# EAGLE schematic mapleCUx_large_047 (EAGLE 7.3.0)
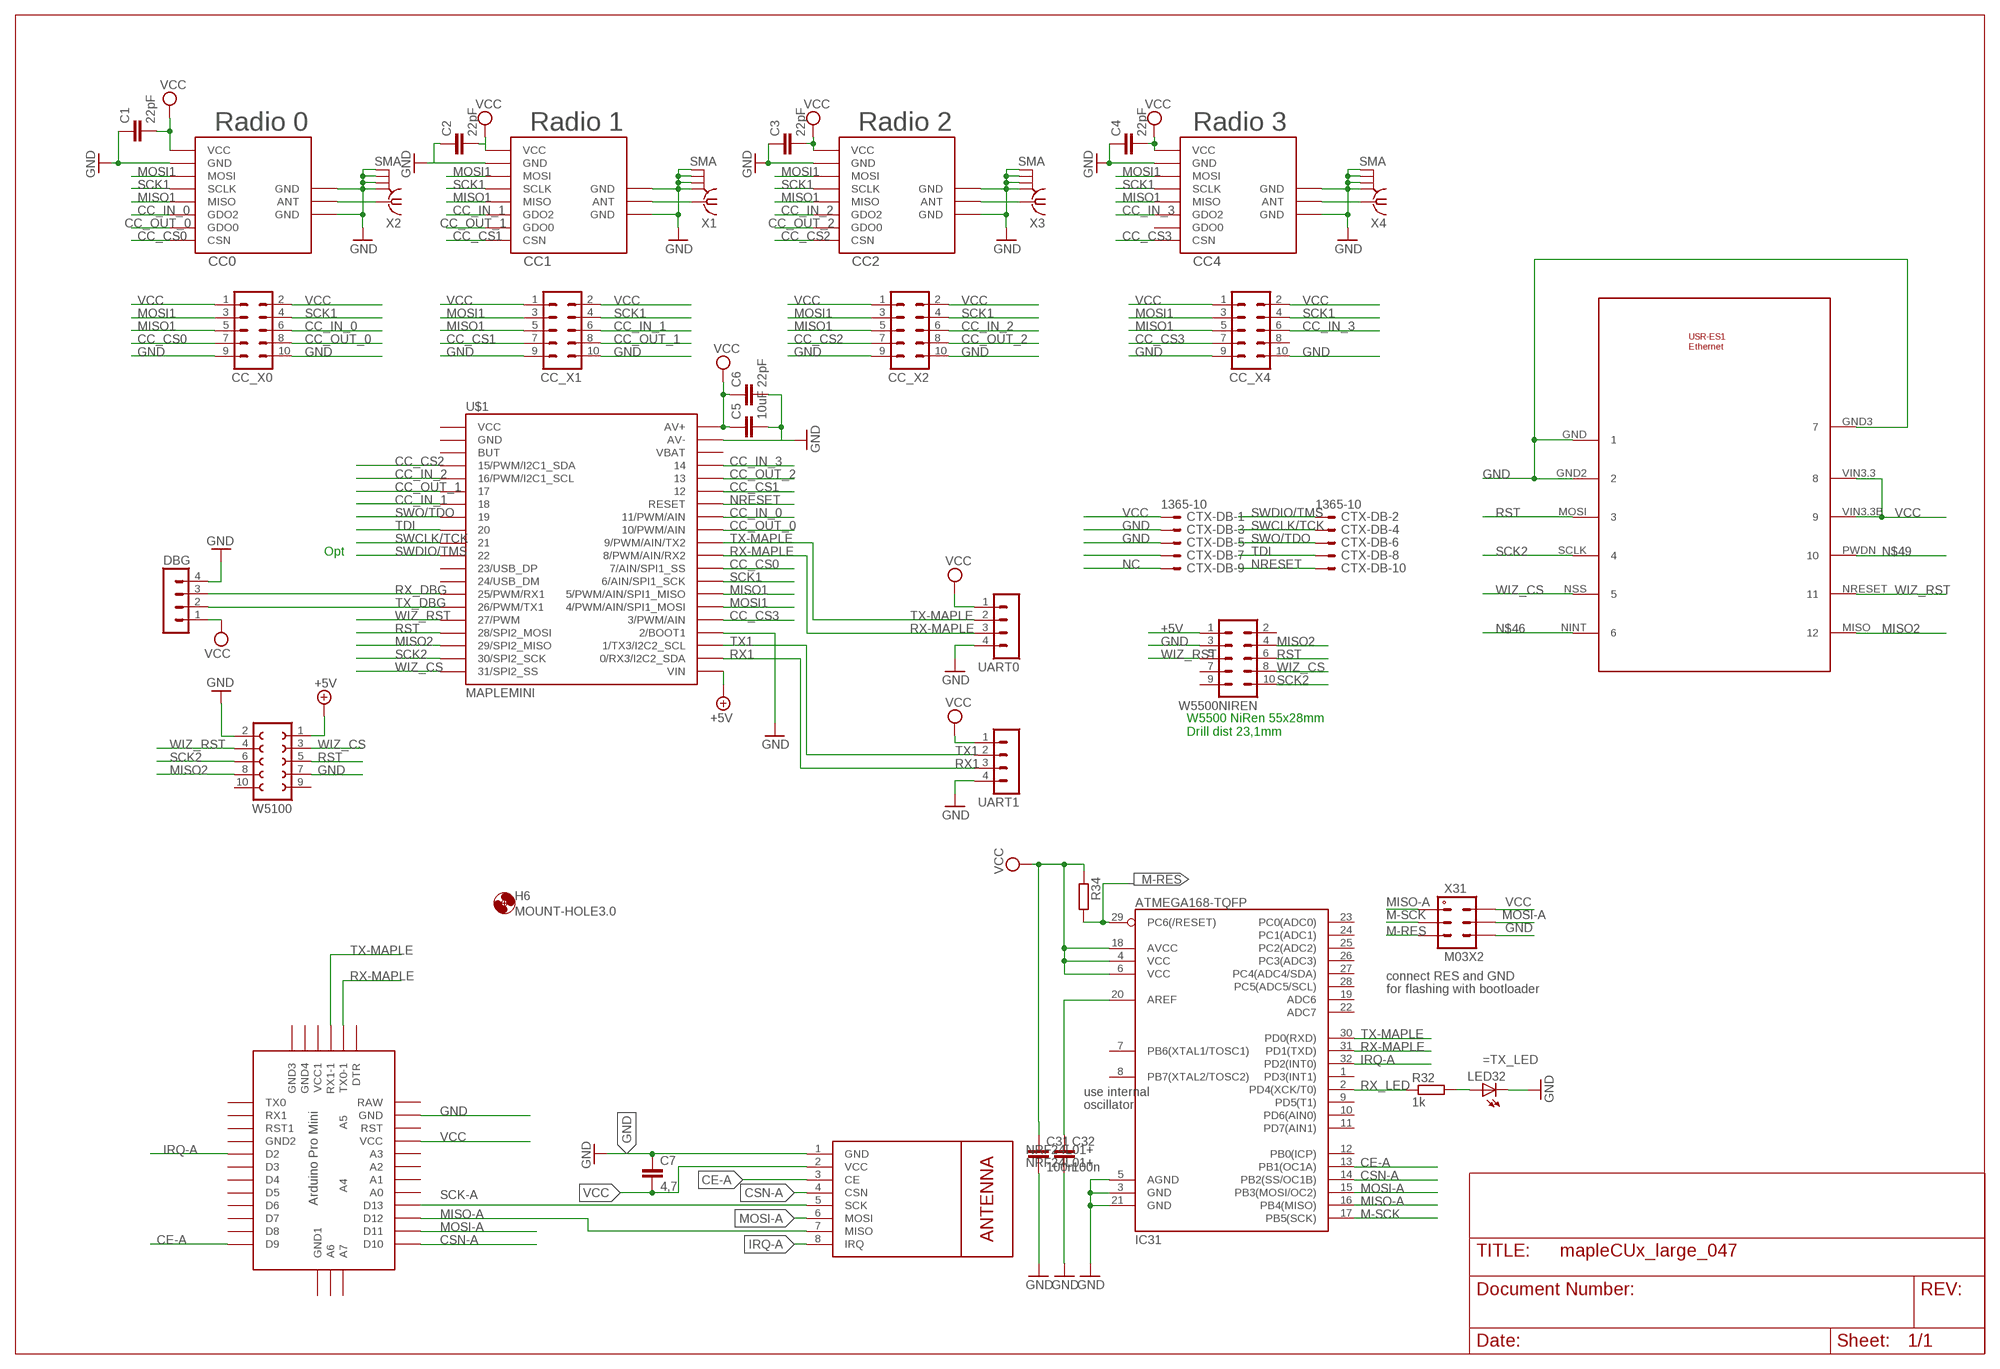
[diagram p0: schematic, sheet 1]

## Parts
C1  22pF  C-EUC0805  [C0805]
C2  22pF  C-EUC0805  [C0805]
C3  22pF  C-EUC0805  [C0805]
C4  22pF  C-EUC0805  [C0805]
C5  10uF  C-EUC1210  [C1210]
C6  22pF  C-EUC0805  [C0805]
C7  4,7  C-EUC1210  [C1210]
C31  100n  C-EUC0805  [C0805]
C32  100n  C-EUC0805  [C0805]
CC0  CC1101_MODULE1SMD  [CC1101_MODULE1_SMD]
CC1  CC1101_MODULE1SMD  [CC1101_MODULE1_SMD]
CC2  CC1101_MODULE1SMD  [CC1101_MODULE1_SMD]
CC4  CC1101_MODULE1SMD  [CC1101_MODULE1_SMD]
CC_X0  MA05-2  [MA05-2]
CC_X1  MA05-2  [MA05-2]
CC_X2  MA05-2  [MA05-2]
CC_X4  MA05-2  [MA05-2]
CTX-DB  1365-10  [1365-10]
DBG  MA04-1  [MA04-1]
H6  MOUNT-HOLE3.0  [3,0]
IC31  ATMEGA168-TQFP  [TQFP32-08]
LED32  LEDCHIPLED_0805  [CHIPLED_0805]
NRF24L01+  NRF24L01+  WIRELESS-NRF24L01  [WIRELESS-NRF24L01]
R32  1k  R-EU_R0805  [R0805]
R34  R-EU_R0805  [R0805]
U$1  MAPLEMINI  [20-DIP]
U$2  ABK-PRO-MINI  [ABK-PRO-MINI]
U$3  USR-ES1  [USR-ES1]
UART0  MA04-1  [MA04-1]
UART1  MA04-1  [MA04-1]
W5100  FE05-2  [FE05-2]
W5500NIREN  MA05-2  [MA05-2]
X1  SMA  [SMA]
X2  SMA  [SMA]
X3  SMA  [SMA]
X4  SMA  [SMA]
X31  M03X2  [2X03-1.27MM_SMD]

## Nets
+5V [PWR]: U$1.21(VIN) W5100.1 W5500NIREN.1
CC_CS0: CC0.CSN CC_X0.7 U$1.29(7/AIN/SPI1_SS)
CC_CS1: CC1.CSN CC_X1.7 U$1.35
CC_CS2: CC2.CSN CC_X2.7 U$1.4(15/PWM/I2C1_SDA)
CC_CS3: CC4.CSN CC_X4.7 U$1.25(3/PWM/AIN)
CC_IN_0: CC0.GDO2 CC_X0.6 U$1.33(11/PWM/AIN)
CC_IN_1: CC1.GDO2 CC_X1.6 U$1.7
CC_IN_2: CC2.GDO2 CC_X2.6 U$1.5(16/PWM/I2C1_SCL)
CC_IN_3: CC4.GDO2 CC_X4.6 U$1.37
CC_OUT_0: CC0.GDO0 CC_X0.8 U$1.32(10/PWM/AIN)
CC_OUT_1: CC1.GDO0 CC_X1.8 U$1.6
CC_OUT_2: CC2.GDO0 CC_X2.8 U$1.36
CE-A: IC31.13(PB1(OC1A)) NRF24L01+.3(CE) U$2.D9
CSN-A: IC31.14(PB2(SS/OC1B)) NRF24L01+.4(CSN) U$2.D10
GND [PWR]: C1.1 C2.1 C3.1 C4.1 C5.2 C6.2 C7.1 C31.2 C32.2 CC0.GND@0(GND) CC0.GND@1(GND) CC0.GND@2(GND) CC1.GND@0(GND) CC1.GND@1(GND) CC1.GND@2(GND) CC2.GND@0(GND) CC2.GND@1(GND) CC2.GND@2(GND) CC4.GND@0(GND) CC4.GND@1(GND) CC4.GND@2(GND) CC_X0.9 CC_X0.10 CC_X1.9 CC_X1.10 CC_X2.9 CC_X2.10 CC_X4.9 CC_X4.10 CTX-DB.3 CTX-DB.5 DBG.4 IC31.3(GND) IC31.5(AGND) IC31.21(GND) LED32.C NRF24L01+.1(GND) U$1.24(2/BOOT1) U$1.39(AV-) U$2.GND U$3.GND U$3.GND2 U$3.GND3 UART0.4 UART1.4 W5100.2 W5100.7 W5500NIREN.3 X1.GND@1 X1.GND@2 X1.GND@3 X1.GND@4 X2.GND@1 X2.GND@2 X2.GND@3 X2.GND@4 X3.GND@1 X3.GND@2 X3.GND@3 X3.GND@4 X4.GND@1 X4.GND@2 X4.GND@3 X4.GND@4 X31.P$6
IRQ-A: IC31.32(PD2(INT0)) NRF24L01+.8(IRQ) U$2.D2
M-RES: IC31.29(PC6(/RESET)) R34.2 X31.P$5
M-SCK: IC31.17(PB5(SCK)) X31.P$3
MISO1: CC0.MISO CC1.MISO CC2.MISO CC4.MISO CC_X0.5 CC_X1.5 CC_X2.5 CC_X4.5 U$1.27(5/PWM/AIN/SPI1_MISO)
MISO2: U$1.18(29/SPI2_MISO) U$3.MISO W5100.8 W5500NIREN.4
MISO-A: IC31.16(PB4(MISO)) NRF24L01+.7(MISO) U$2.D12 X31.P$1
MOSI1: CC0.MOSI CC1.MOSI CC2.MOSI CC4.MOSI CC_X0.3 CC_X1.3 CC_X2.3 CC_X4.3 U$1.26(4/PWM/AIN/SPI1_MOSI)
MOSI-A: IC31.15(PB3(MOSI/OC2)) NRF24L01+.6(MOSI) U$2.D11 X31.P$4
N$1: CC2.ANT X3.1
N$2: CC4.ANT X4.1
N$3: CC1.ANT X1.1
N$4: CC0.ANT X2.1
N$5: LED32.A R32.2
N$8: CTX-DB.7
N$15: C32.1 IC31.20(AREF)
N$46: U$3.NINT
N$49: U$3.PWDN
NC: CTX-DB.9
NRESET: CTX-DB.10 U$1.34(RESET)
RST: U$1.17(28/SPI2_MOSI) U$3.MOSI W5100.5 W5500NIREN.6
RX1: U$1.22(0/RX3/I2C2_SDA) UART1.3
RX-MAPLE: IC31.31(PD1(TXD)) U$1.30(8/PWM/AIN/RX2) U$2.TX0-1 UART0.3
RX_DBG: DBG.3 U$1.14(25/PWM/RX1)
RX_LED: IC31.2(PD4(XCK/T0)) R32.1
SCK1: CC0.SCLK CC1.SCLK CC2.SCLK CC4.SCLK CC_X0.4 CC_X1.4 CC_X2.4 CC_X4.4 U$1.28(6/AIN/SPI1_SCK)
SCK2: U$1.19(30/SPI2_SCK) U$3.SCLK W5100.6 W5500NIREN.10
SCK-A: NRF24L01+.5(SCK) U$2.D13
SWCLK/TCK: CTX-DB.4 U$1.10
SWDIO/TMS: CTX-DB.2 U$1.11
SWO/TDO: CTX-DB.6 U$1.8
TDI: CTX-DB.8 U$1.9
TX1: U$1.23(1/TX3/I2C2_SCL) UART1.2
TX-MAPLE: IC31.30(PD0(RXD)) U$1.31(9/PWM/AIN/TX2) U$2.RX1-1 UART0.2
TX_DBG: DBG.2 U$1.15(26/PWM/TX1)
VCC [PWR]: C1.2 C2.2 C3.2 C4.2 C5.1 C6.1 C7.2 C31.1 CC0.VCC CC1.VCC CC2.VCC CC4.VCC CC_X0.1 CC_X0.2 CC_X1.1 CC_X1.2 CC_X2.1 CC_X2.2 CC_X4.1 CC_X4.2 CTX-DB.1 DBG.1 IC31.4(VCC) IC31.6(VCC) IC31.18(AVCC) NRF24L01+.2(VCC) R34.1 U$1.40(AV+) U$2.VCC U$3.VIN3.3 U$3.VIN3.3B UART0.1 UART1.1 X31.P$2
WIZ_CS: U$1.20(31/SPI2_SS) U$3.NSS W5100.3 W5500NIREN.8
WIZ_RST: U$1.16(27/PWM) U$3.NRESET W5100.4 W5500NIREN.5
Unconnected: CC4.GDO0 CC_X4.8 IC31.1(PD3(INT1)) IC31.7(PB6(XTAL1/TOSC1)) IC31.8(PB7(XTAL2/TOSC2)) IC31.9(PD5(T1)) IC31.10(PD6(AIN0)) IC31.11(PD7(AIN1)) IC31.12(PB0(ICP)) IC31.19(ADC6) IC31.22(ADC7) IC31.23(PC0(ADC0)) IC31.24(PC1(ADC1)) IC31.25(PC2(ADC2)) IC31.26(PC3(ADC3)) IC31.27(PC4(ADC4/SDA)) IC31.28(PC5(ADC5/SCL)) U$1.1(VCC) U$1.2(GND) U$1.3(BUT) U$1.12(23/USB_DP) U$1.13(24/USB_DM) U$1.38(VBAT) U$2.A0 U$2.A1 U$2.A2 U$2.A3 U$2.A4 U$2.A5 U$2.A6 U$2.A7 U$2.D3 U$2.D4 U$2.D5 U$2.D6 U$2.D7 U$2.D8 U$2.DTR U$2.GND1(GND2) U$2.GND2(GND3) U$2.GND3(GND4) U$2.GND4(GND1) U$2.RAW U$2.RST U$2.RST1 U$2.RX1 U$2.TX0 U$2.VCC1 W5100.9 W5100.10 W5500NIREN.2 W5500NIREN.7 W5500NIREN.9

## Notes on the sheet
- Radio 0 | Radio 1 | Radio 2 | Radio 3
- Opt
- W5500 NiRen 55x28mm
  Drill dist 23,1mm
- connect RES and GND
- for flashing with bootloader
- =TX_LED
- use internal
- oscillator

## Library data of the parts
C1-C7 C31 C32 = rcl:C-EU: CAPACITOR, European symbol
CC0 CC1 CC2 CC4 = wireless:CC1101_MODULE1: CC1101 wireless module for 433/868 MHz (sold from Aliexpress). DIL version for mounting with pin header (and SMD soldering) and SMD only variant available.
CC_X0 CC_X1 CC_X2 CC_X4 W5500NIREN = con-lstb:MA05-2: PIN HEADER; OC_FARNELL: unknown; OC_NEWARK: unknown
CTX-DB = con-leotronics:1365-10: DUAL ROW STRAIGHT HEADER 1364 SERIES. 1.27mm x 1.27mm. Without Fixing Post. SMT Source: http://www.leotronics.co.uk/Conexcon/Data%20Sheets/sec.%20A/1364ing.pdf; OC_FARNELL: unknown; OC_NEWARK: unknown
DBG UART0 UART1 = con-lstb:MA04-1: PIN HEADER; OC_FARNELL: unknown; OC_NEWARK: unknown
H6 = holes:MOUNT-HOLE: MOUNTING HOLE with drill center marker
IC31 = atmel:ATMEGA168: Atmel Atmega 168/328/328P
LED32 = led:LED: LED OSRAM: - CHIPLED LG R971, LG N971, LY N971, LG Q971, LY Q971, LO R971, LY R971 LH N974, LH R974 LS Q976, LO Q976, LY Q976 LO Q996 - Hyper CHIPLED LW Q18S LB Q993, LB Q99A, LB R99A - SideLED LS A670, LO A670, LY A670, LG A670, LP A670 LB A673, LV A673, LT A673, LW A673 LH A674 LY A675 LS A676, LA A676, LO A676, LY A676, LW A676 LS A679, LY A679, LG A679 - Hyper Micro SIDELED® LS Y876, LA Y876, LO Y876, LY Y876 LT Y87S - SmartLED LW L88C, LW L88S LB L89C, LB L89S, LG L890 LS L89K, LO L89K, LY L89K LS L896, LA L896, LO L896, LY L896 - TOPLED LS T670, LO T670, LY T670, LG T670, LP T670 LSG T670, LSP T670, LSY T670, LOP T670, LYG T670 LG T671, LOG T671, LSG T671 LB T673, LV T673, LT T673, LW T673 LH T674 LS T676, LA T676, LO T676, LY T676, LB T676, LH T676, LSB T676, LW T676 LB T67C, LV T67C, LT T67C, LS T67K, LO T67K, LY T67K, LW E67C LS E67B, LA E67B, LO E67B, LY E67B, LB E67C, LV E67C, LT E67C LW T67C LS T679, LY T679, LG T679 LS T770, LO T770, LY T770, LG T770, LP T770 LB T773, LV T773, LT T773, LW T773 LH T774 LS E675, LA E675, LY E675, LS T675 LS T776, LA T776, LO T776, LY T776, LB T776 LHGB T686 LT T68C, LB T68C - Hyper Mini TOPLED® LB M676 - Mini TOPLED Santana® LG M470 LS M47K, LO M47K, LY M47K Source: http://www.osram.convergy.de LUXEON: - LUMILED® LXK2-PW12-R00, LXK2-PW12-S00, LXK2-PW14-U00, LXK2-PW14-V00 LXK2-PM12-R00, LXK2-PM12-S00, LXK2-PM14-U00 LXK2-PE12-Q00, LXK2-PE12-R00, LXK2-PE12-S00, LXK2-PE14-T00, LXK2-PE14-U00 LXK2-PB12-K00, LXK2-PB12-L00, LXK2-PB12-M00, LXK2-PB14-N00, LXK2-PB14-P00, LXK2-PB14-Q00 LXK2-PR12-L00, LXK2-PR12-M00, LXK2-PR14-Q00, LXK2-PR14-R00 LXK2-PD12-Q00, LXK2-PD12-R00, LXK2-PD12-S00 LXK2-PH12-R00, LXK2-PH12-S00 LXK2-PL12-P00, LXK2-PL12-Q00, LXK2-PL12-R00 Source: www.luxeon.com KINGBRIGHT: KA-3528ASYC Source: www.kingbright.com
NRF24L01+ = diy-modules:WIRELESS-NRF24L01: 2.4 GHz Wireless Module based on NRF24L01 chip
R32 R34 = rcl:R-EU_: RESISTOR, European symbol
U$1 = maplemini-small:MAPLEMINI
U$2 = Arduino-clone:ABK-PRO-MINI: ABK Pro-Mini Arduino Clone
U$3 = Martin:USR-ES1: W5500 LAN Module
W5100 = con-lsta:FE05-2: FEMALE HEADER; OC_FARNELL: unknown; OC_NEWARK: unknown
X1-X4 = sma:SMA: SMA 50 Ohm end launch jack receptacle - round contact
X31 = mechanics:M03X2

## Net classes
1 PWR: width 0.508 mm